# Altium schematic sheet circuit.SchDoc
size A3
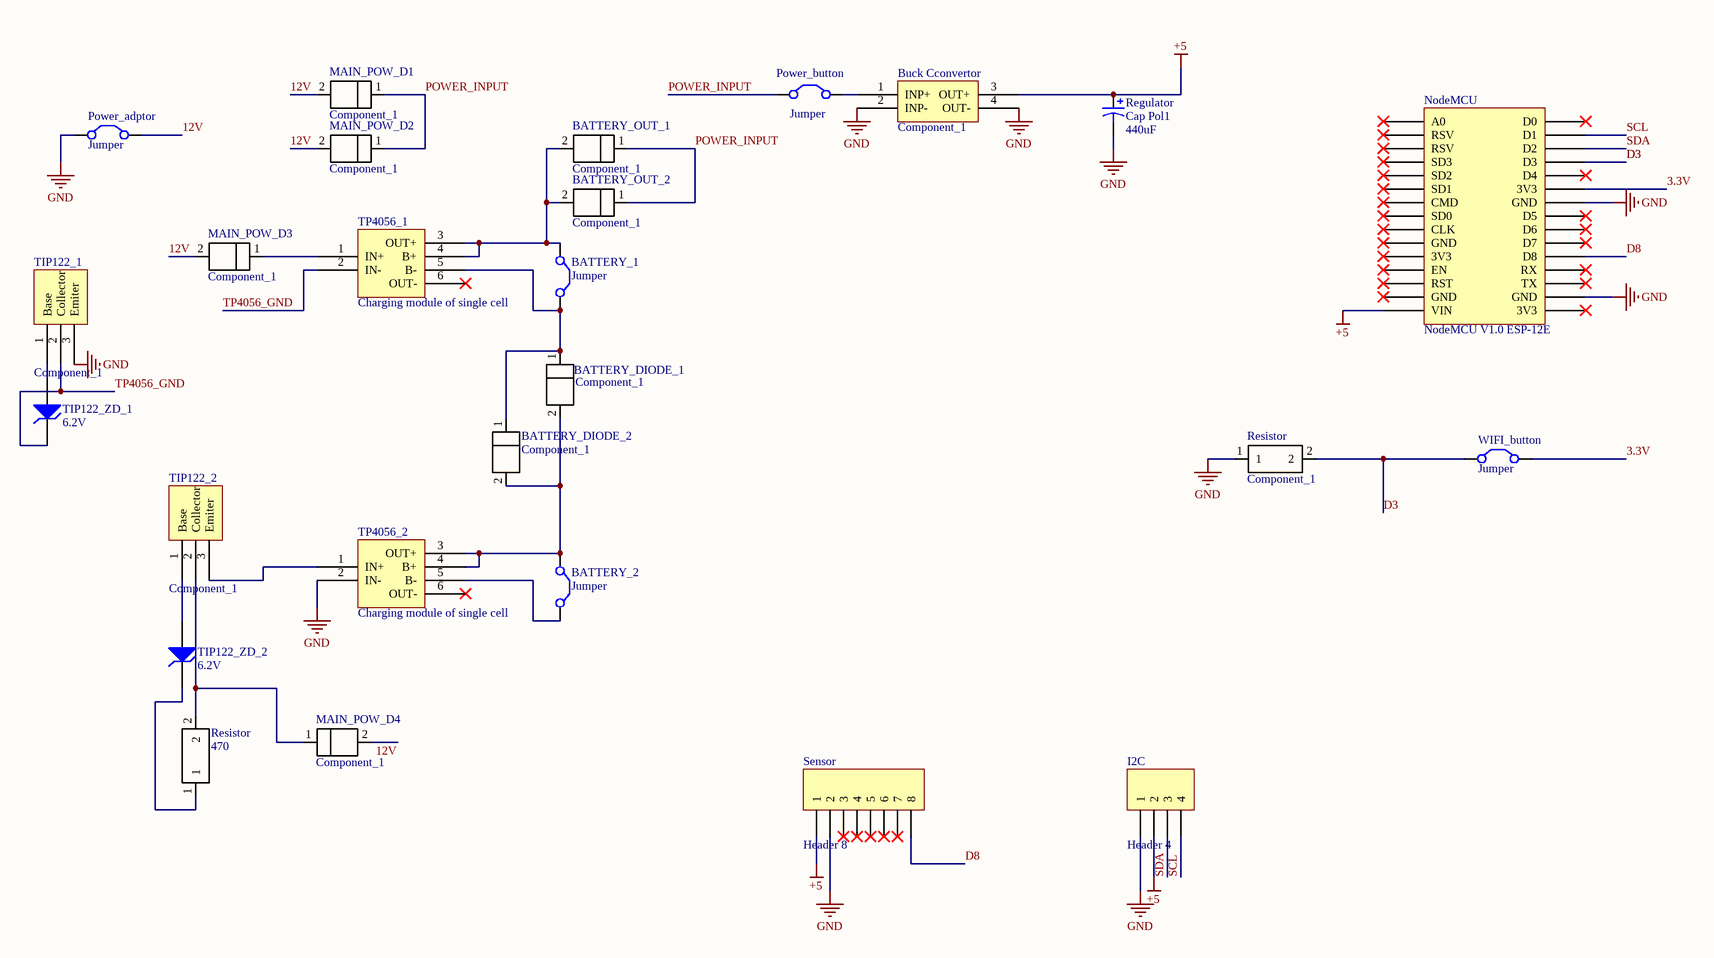
[diagram p0: circuit.SchDoc]

## Parts
(Parts that share a designator on the sheet are numbered #1, #2 ... from top to bottom, then left to right.)
BATTERY_1  Jumper  [RAD-0.2]
BATTERY_2  Jumper  [RAD-0.2]
BATTERY_DIODE_1  Component_1  [PCBComponent_1]
BATTERY_DIODE_2  Component_1  [PCBComponent_1]
BATTERY_OUT_1  Component_1  [PCBComponent_1]
BATTERY_OUT_2  Component_1  [PCBComponent_1]
Buck_Cconvertor  Component_1  [PCBComponent_1]
I2C  Header 4  [HDR1X4]
MAIN_POW_D1  Component_1  [PCBComponent_1]
MAIN_POW_D2  Component_1  [PCBComponent_1]
MAIN_POW_D3  Component_1  [PCBComponent_1]
MAIN_POW_D4  Component_1  [PCBComponent_1]
NodeMCU  NodeMCU V1.0 ESP-12E  [NodeMCU V1.0 ESP-12E]
Power_adptor  Jumper  [RAD-0.2]
Power_button  Jumper  [RAD-0.2]
Regulator  Cap Pol1  value 440uF  [RB7.6-15]
Resistor#1  Component_1  [PCBComponent_1]
Resistor#2  470  [PCBComponent_1]
Sensor  Header 8  [HDR1X8]
TIP122_1  Component_1  [PCBComponent_1]
TIP122_2  Component_1  [PCBComponent_1]
TIP122_ZD_1  6.2V  [DIODE-0.7]
TIP122_ZD_2  6.2V  [DIODE-0.7]
TP4056_1  Charging module of single cell  [PCBComponent_1]
TP4056_2  Charging module of single cell  [PCBComponent_1]
WIFI_button  Jumper  [RAD-0.2]

## Nets
+5: Buck_Cconvertor.3(OUT+) I2C.2 NodeMCU.VIN Regulator.1 Sensor.1
GND: Buck_Cconvertor.2(INP-) Buck_Cconvertor.4(OUT-) I2C.1 NodeMCU.GND Power_adptor.1(C1) Regulator.2 Resistor#1.1 Sensor.2 TIP122_1.3(Emiter) TP4056_2.2(IN-)
3.3V: NodeMCU.3V3 WIFI_button.2(C2)
12V: MAIN_POW_D1.2 MAIN_POW_D2.2 MAIN_POW_D3.2 MAIN_POW_D4.2 Power_adptor.2(C2)
D3: NodeMCU.D3 Resistor#1.2 WIFI_button.1(C1)
D8: NodeMCU.D8 Sensor.8
POWER_INPUT: BATTERY_OUT_1.1 BATTERY_OUT_2.1 MAIN_POW_D1.1 MAIN_POW_D2.1 Power_button.1(C1)
SCL: I2C.4 NodeMCU.D1
SDA: I2C.3 NodeMCU.D2
TP4056_GND: TIP122_1.2(Collector) TIP122_ZD_1.2(K) TP4056_1.2(IN-)
NetBATTERY_1_1: BATTERY_1.1(C1) BATTERY_OUT_1.2 BATTERY_OUT_2.2 TP4056_1.3(OUT+) TP4056_1.4(B+)
NetBATTERY_1_2: BATTERY_1.2(C2) BATTERY_DIODE_1.1 BATTERY_DIODE_2.1 TP4056_1.5(B-)
NetBATTERY_2_1: BATTERY_2.1(C1) BATTERY_DIODE_1.2 BATTERY_DIODE_2.2 TP4056_2.3(OUT+) TP4056_2.4(B+)
NetBATTERY_2_2: BATTERY_2.2(C2) TP4056_2.5(B-)
NetBuck_Cconvertor_1: Buck_Cconvertor.1(INP+) Power_button.2(C2)
NetMAIN_POW_D3_1: MAIN_POW_D3.1 TP4056_1.1(IN+)
NetMAIN_POW_D4_1: MAIN_POW_D4.1 Resistor#2.2 TIP122_2.2(Collector)
NetResistor#2_1: Resistor#2.1 TIP122_ZD_2.2(K)
NetTIP122_1_1: TIP122_1.1(Base) TIP122_ZD_1.1(A)
NetTIP122_2_1: TIP122_2.1(Base) TIP122_ZD_2.1(A)
NetTIP122_2_3: TIP122_2.3(Emiter) TP4056_2.1(IN+)

Not connected (* = marked no-connect by the designer): NodeMCU A0* CLK* CMD* D0* D4* D5* D6* D7* EN* RST* RSV* RX* SD0* SD1* SD2* SD3* TX*; Sensor 3* 4* 5* 6* 7*; TP4056_1 6(OUT-)*; TP4056_2 6(OUT-)*

## Notes on the sheet
- Title
- Size:
- Date:
- A3
- Number:
- Time:
- Revision:
- Sheet
- of
- File:

## Library data of the parts
BATTERY_1 BATTERY_2 Power_adptor Power_button WIFI_button = Jumper: Jumper Wire; Published: 24-Mar-1999; LatestRevisionDate: 17-Jul-2002; LatestRevisionNote: Re-released for DXP Platform.; PackageReference: RAD-0.2; Publisher: Altium Limited; PackageDescription: Radial Cap, Thru-Hole; 2 Leads; 0.2 in Pin Spacing
I2C = Header 4: Header, 4-Pin; LatestRevisionDate: 17-Jul-2002; LatestRevisionNote: Re-released for DXP Platform.; Publisher: Altium Limited
NodeMCU = NodeMCU V1.0 ESP-12E: NodeMCU V1.0 ESP8266 (ESP-12E)
Regulator = Cap Pol1: Polarized Capacitor (Radial); Published: 8-Jun-2000; LatestRevisionDate: 17-Jul-2002; LatestRevisionNote: Re-released for DXP Platform.; PackageReference: RB7.6-15; Publisher: Altium Limited; PackageDescription: Polarized Capacitor (Radial); 2 Leads
Resistor#2 = Component_1
Sensor = Header 8: Header, 8-Pin; LatestRevisionDate: 17-Jul-2002; LatestRevisionNote: Re-released for DXP Platform.; Publisher: Altium Limited
TIP122_ZD_1 TIP122_ZD_2 = D Zener: Zener Diode; Published: 8-Jun-2000; LatestRevisionDate: 17-Jul-2002; LatestRevisionNote: Re-released for DXP Platform.; PackageReference: DIODE-0.7; Publisher: Altium Limited; PackageDescription: Diode, Thru-Hole; 2 Leads; 0.7 in Pin Spacing
TP4056_1 TP4056_2 = Tp4056 module